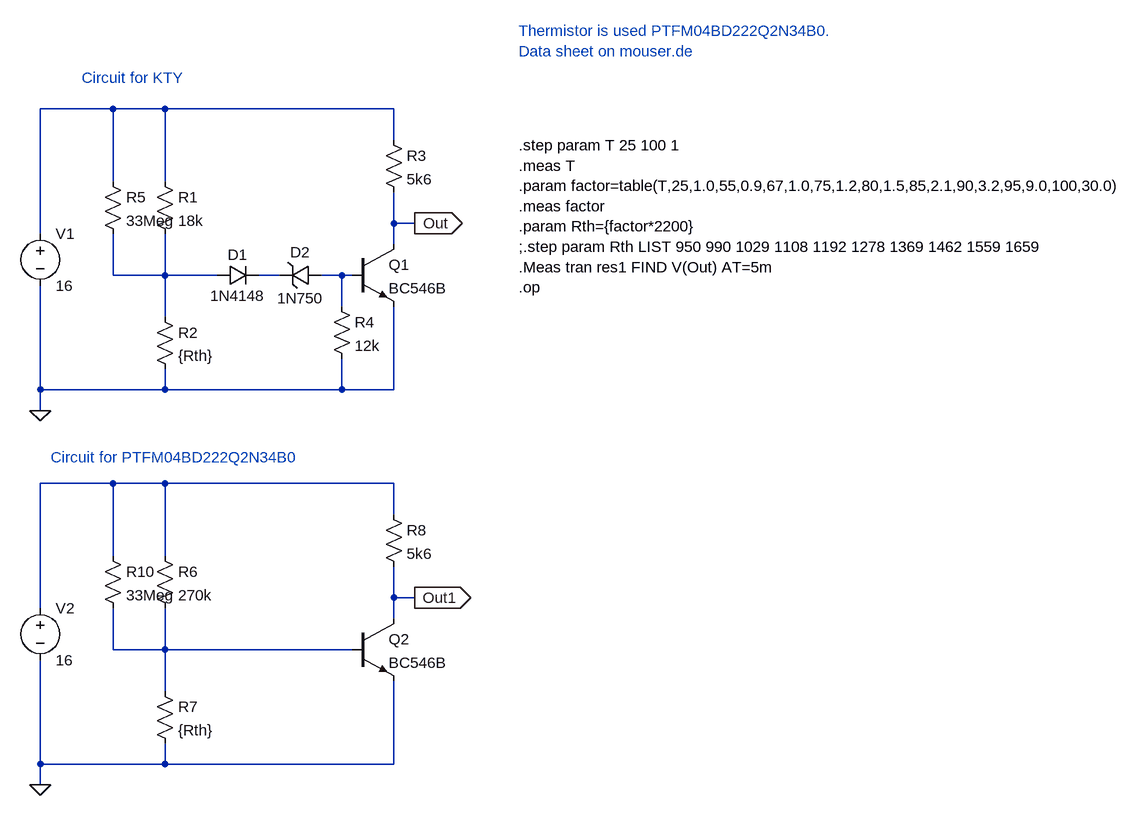
[diagram p0: schematic Spice Test Temp KTY.asc]
Spice Test Temp KTY.asc, the LTspice schematic file:
Version 4
SHEET 1 1516 1072
WIRE -96 16 -208 16
WIRE -16 16 -96 16
WIRE 336 16 -16 16
WIRE 336 64 336 16
WIRE -96 128 -96 16
WIRE -16 128 -16 16
WIRE 336 192 336 144
WIRE 368 192 336 192
WIRE -208 208 -208 16
WIRE 336 224 336 192
WIRE -96 272 -96 208
WIRE -16 272 -16 208
WIRE -16 272 -96 272
WIRE 64 272 -16 272
WIRE 160 272 128 272
WIRE 256 272 224 272
WIRE 272 272 256 272
WIRE 256 320 256 272
WIRE -16 336 -16 272
WIRE -208 448 -208 288
WIRE -16 448 -16 416
WIRE -16 448 -208 448
WIRE 256 448 256 400
WIRE 256 448 -16 448
WIRE 336 448 336 320
WIRE 336 448 256 448
WIRE -208 480 -208 448
WIRE -96 592 -208 592
WIRE -16 592 -96 592
WIRE 336 592 -16 592
WIRE 336 640 336 592
WIRE -96 704 -96 592
WIRE -16 704 -16 592
WIRE 336 768 336 720
WIRE 368 768 336 768
WIRE -208 784 -208 592
WIRE 336 800 336 768
WIRE -96 848 -96 784
WIRE -16 848 -16 784
WIRE -16 848 -96 848
WIRE 272 848 -16 848
WIRE -16 912 -16 848
WIRE -208 1024 -208 864
WIRE -16 1024 -16 992
WIRE -16 1024 -208 1024
WIRE 336 1024 336 896
WIRE 336 1024 -16 1024
WIRE -208 1056 -208 1024
FLAG -208 480 0
FLAG 368 192 Out
IOPIN 368 192 Out
FLAG -208 1056 0
FLAG 368 768 Out1
IOPIN 368 768 Out
SYMBOL res -32 112 R0
SYMATTR InstName R1
SYMATTR Value 18k
SYMBOL res -32 320 R0
SYMATTR InstName R2
SYMATTR Value {Rth}
SYMBOL diode 64 288 R270
WINDOW 0 32 32 VTop 2
WINDOW 3 0 32 VBottom 2
SYMATTR InstName D1
SYMATTR Value 1N4148
SYMBOL zener 224 256 R90
WINDOW 0 -4 32 VBottom 2
WINDOW 3 36 32 VTop 2
SYMATTR InstName D2
SYMATTR Value 1N750
SYMBOL npn 272 224 R0
SYMATTR InstName Q1
SYMATTR Value BC546B
SYMBOL res 320 48 R0
SYMATTR InstName R3
SYMATTR Value 5k6
SYMBOL voltage -208 192 R0
SYMATTR InstName V1
SYMATTR Value 16
SYMBOL res 240 304 R0
SYMATTR InstName R4
SYMATTR Value 12k
SYMBOL res -112 112 R0
SYMATTR InstName R5
SYMATTR Value 33Meg
SYMBOL res -32 688 R0
SYMATTR InstName R6
SYMATTR Value 270k
SYMBOL res -32 896 R0
SYMATTR InstName R7
SYMATTR Value {Rth}
SYMBOL npn 272 800 R0
SYMATTR InstName Q2
SYMATTR Value BC546B
SYMBOL res 320 624 R0
SYMATTR InstName R8
SYMATTR Value 5k6
SYMBOL voltage -208 768 R0
SYMATTR InstName V2
SYMATTR Value 16
SYMBOL res -112 688 R0
SYMATTR InstName R10
SYMATTR Value 33Meg
TEXT 528 72 Left 2 !.step param T 25 100 1\n.meas T\n.param factor=table(T,25,1.0,55,0.9,67,1.0,75,1.2,80,1.5,85,2.1,90,3.2,95,9.0,100,30.0)\n.meas factor\n.param Rth={factor*2200}\n;.step param Rth LIST 950 990 1029 1108 1192 1278 1369 1462 1559 1659\n.Meas tran res1 FIND V(Out) AT=5m\n.op
TEXT 528 -104 Left 2 ;Thermistor is used PTFM04BD222Q2N34B0.\nData sheet on mouser.de
TEXT -144 -32 Left 2 ;Circuit for KTY
TEXT -192 552 Left 2 ;Circuit for PTFM04BD222Q2N34B0

The netlist it stands for:
* Spice Test Temp KTY.asc
R1 N001 N002 18k
R2 N002 0 {Rth}
D1 N002 N003 1N4148
D2 N004 N003 1N750
Q1 Out N004 0 0 BC546B
R3 N001 Out 5k6
V1 N001 0 16
R4 N004 0 12k
R5 N001 N002 33Meg
R6 N005 N006 270k
R7 N006 0 {Rth}
Q2 Out1 N006 0 0 BC546B
R8 N005 Out1 5k6
V2 N005 0 16
R10 N005 N006 33Meg
.model D D
.lib standard.dio
.model NPN NPN
.model PNP PNP
.lib standard.bjt
.step param T 25 100 1
.meas T
.param factor=table(T,25,1.0,55,0.9,67,1.0,75,1.2,80,1.5,85,2.1,90,3.2,95,9.0,100,30.0)
.meas factor
.param Rth={factor*2200}
;.step param Rth LIST 950 990 1029 1108 1192 1278 1369 1462 1559 1659
.Meas tran res1 FIND V(Out) AT=5m
.op
* Thermistor is used PTFM04BD222Q2N34B0.
* Data sheet on mouser.de
* Circuit for KTY
* Circuit for PTFM04BD222Q2N34B0
.backanno
.end